# Altium schematic sheet [05] - PROCESSOR 2 of 3, USB and SERIAL.SchDoc
size A2; DocumentNumber: 5; SheetNumber: 5; SheetTotal: 13; NameAuthor: Angle Vu
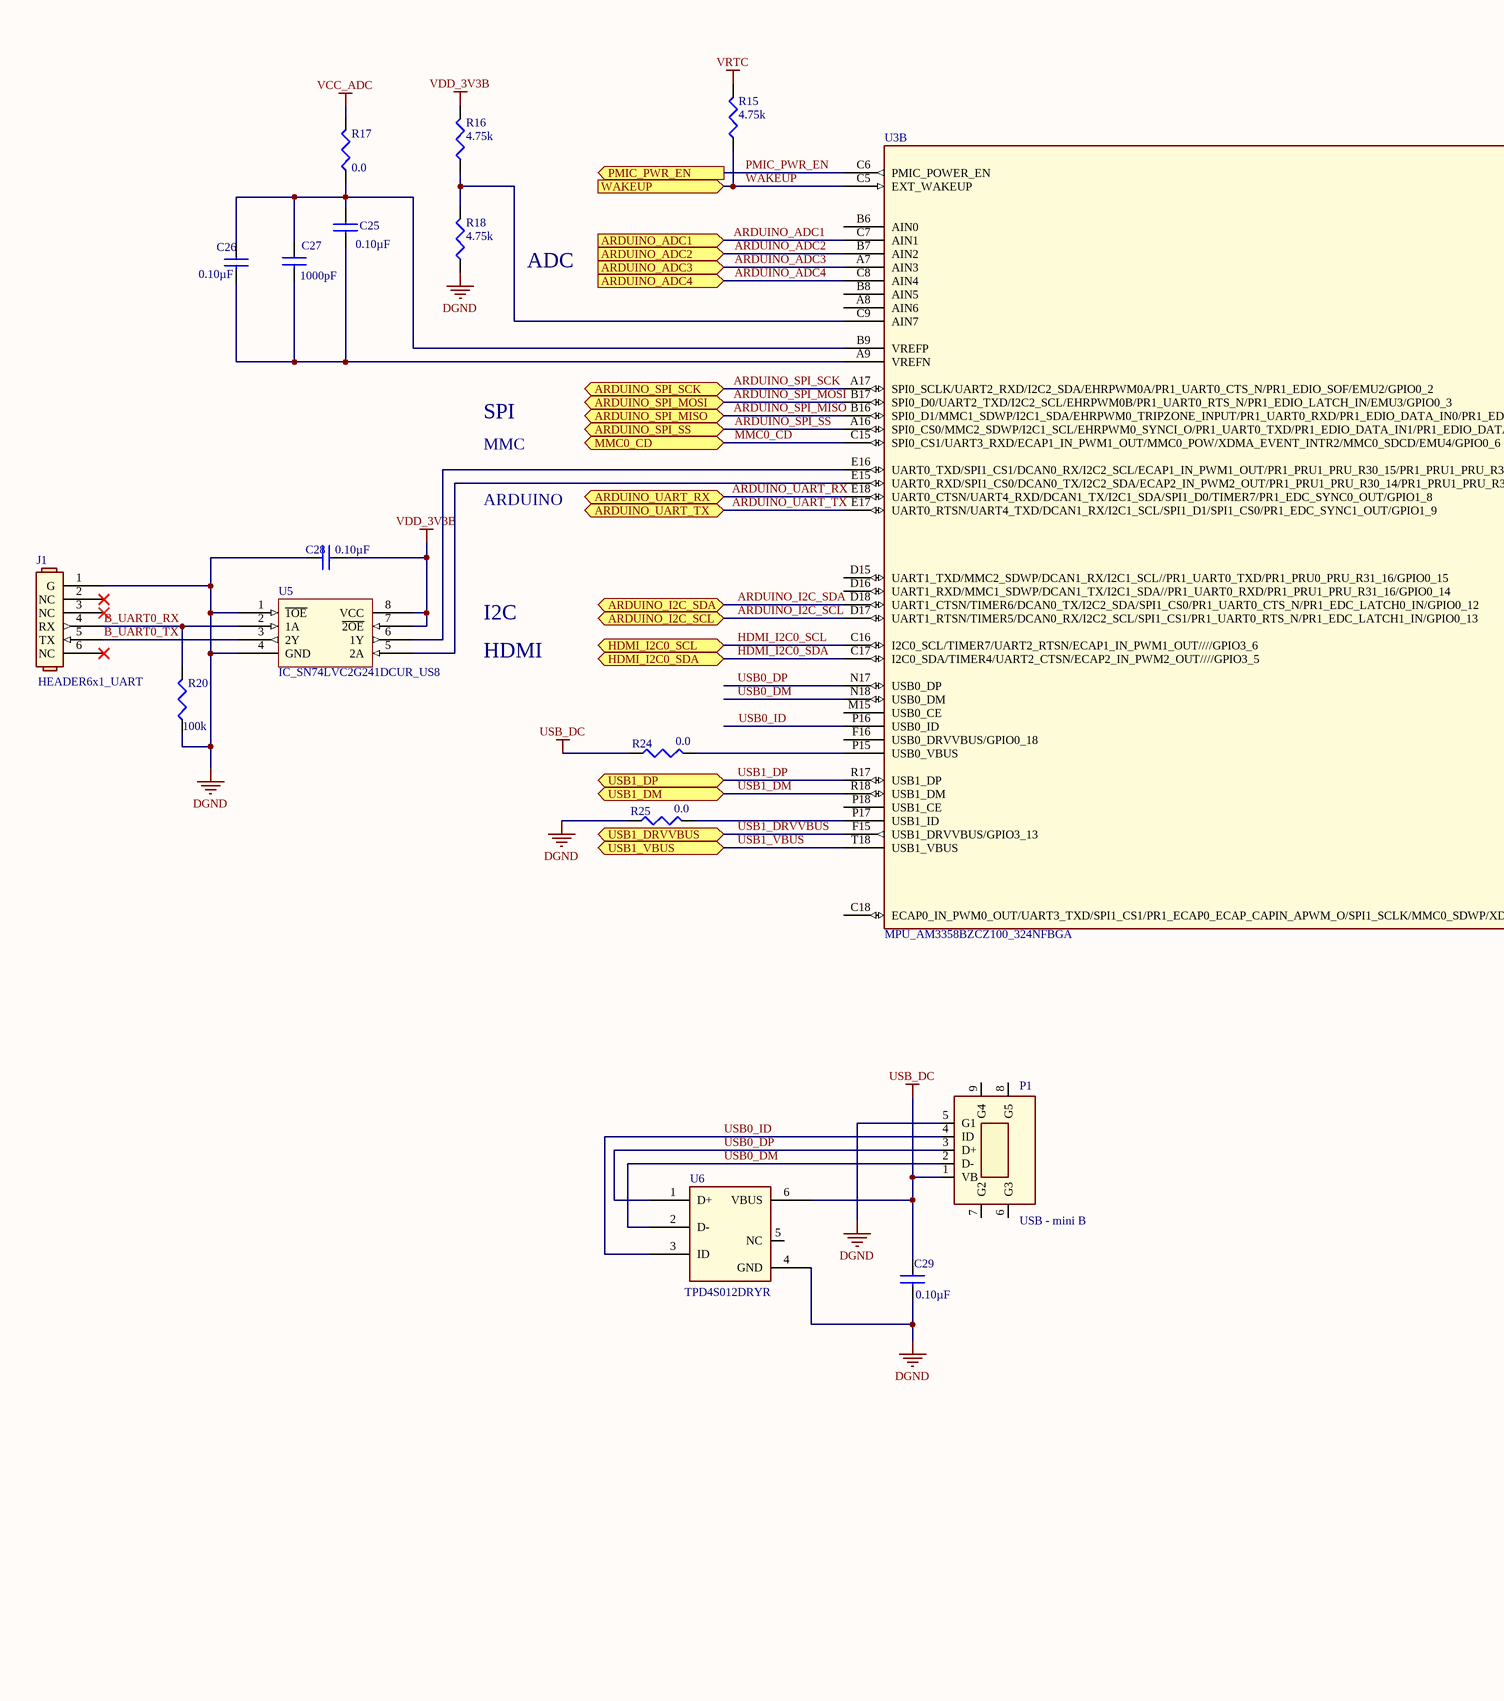
[diagram p0: [05] - PROCESSOR 2 of 3, USB and SERIAL.SchDoc, left]
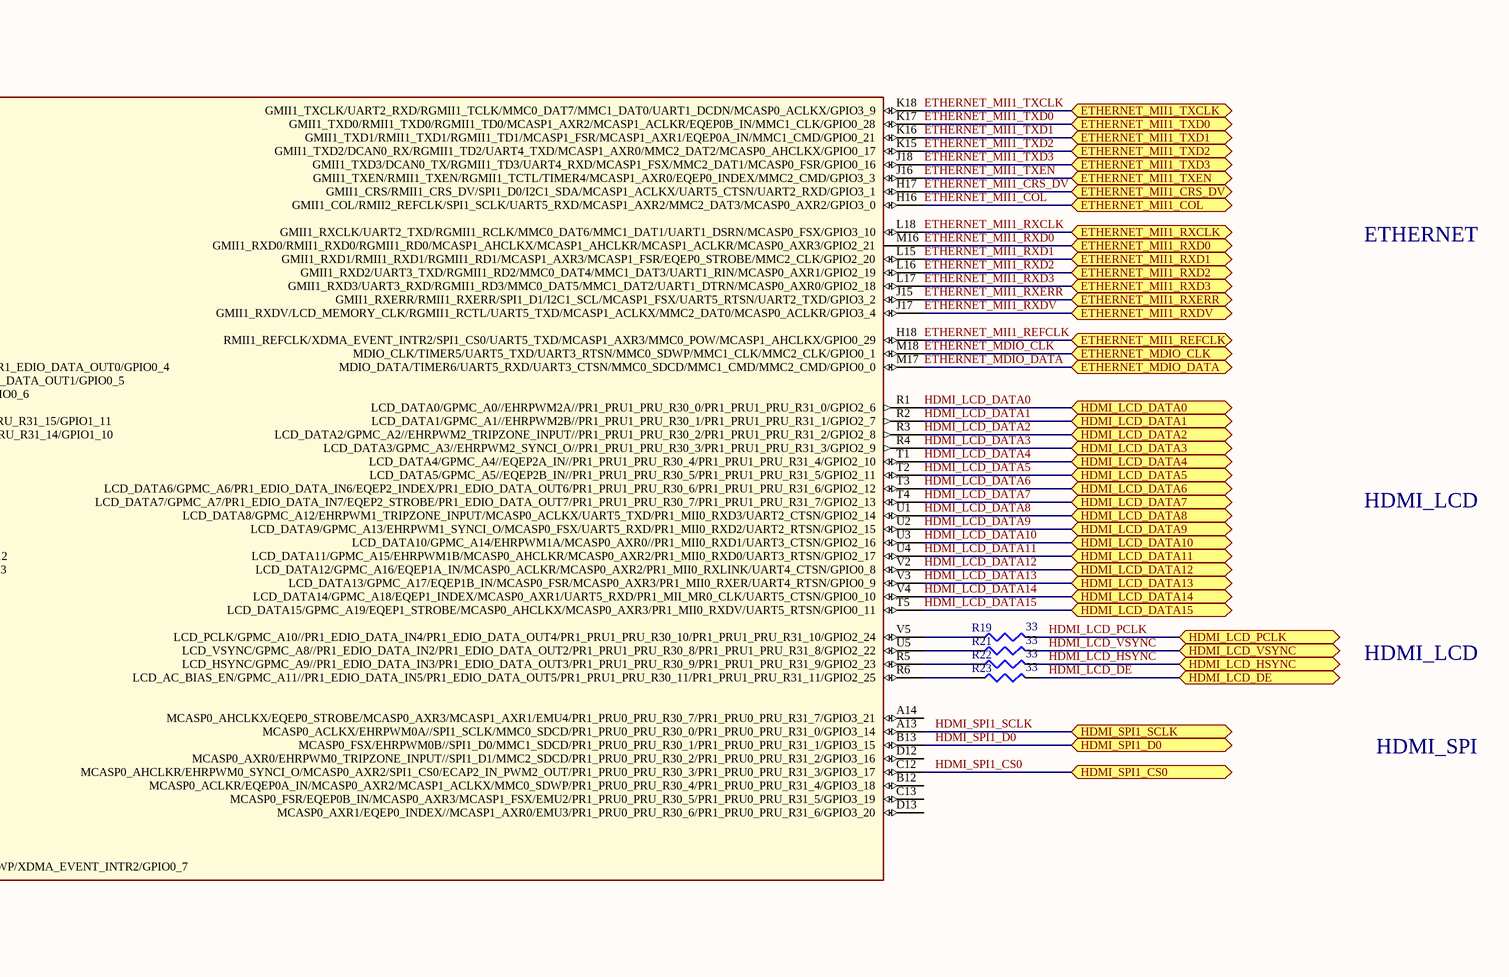
[diagram p1: [05] - PROCESSOR 2 of 3, USB and SERIAL.SchDoc, right]

## Parts
C25  Capacitance: 0.10µF  (hidden comment: C_CER_0.1uF_6.3V_X5R_0402_10%)
C26  Capacitance: 0.10µF  (hidden comment: C_CER_0.1uF_6.3V_X5R_0402_10%)
C27  Capacitance: 1000pF  (hidden comment: C_CER_1000pF_16V_X5R_0402_10%)
C28  Capacitance: 0.10µF  (hidden comment: C_CER_0.1uF_6.3V_X5R_0402_10%)
C29  Capacitance: 0.10µF  (hidden comment: C_CER_0.1uF_6.3V_X5R_0402_10%)
J1  HEADER6x1_UART
P1  Connector Type: USB - mini B  (hidden comment: PWR_MINI_USB_UX60SC-MB-5ST(80))
R15  Resistance (Ohms): 4.75k  (hidden comment: R_4.75K_1/16W_0402_1%)
R16  Resistance (Ohms): 4.75k  (hidden comment: R_4.75K_1/16W_0402_1%)
R17  Resistance (Ohms): 0.0  (hidden comment: R_0OhM_1/16W_0402)
R18  Resistance (Ohms): 4.75k  (hidden comment: R_4.75K_1/16W_0402_1%)
R19  Resistance (Ohms): 33  (hidden comment: R_33_1/16W_0402_5%)
R20  Resistance (Ohms): 100k  (hidden comment: R_100k_1/16W_0402_1%)
R21  Resistance (Ohms): 33  (hidden comment: R_33_1/16W_0402_5%)
R22  Resistance (Ohms): 33  (hidden comment: R_33_1/16W_0402_5%)
R23  Resistance (Ohms): 33  (hidden comment: R_33_1/16W_0402_5%)
R24  Resistance (Ohms): 0.0  (hidden comment: R_0OhM_1/16W_0402)
R25  Resistance (Ohms): 0.0  (hidden comment: R_0OhM_1/16W_0402)
U3  MPU_AM3358BZCZ100_324NFBGA  (part B of 3)
U5  IC_SN74LVC2G241DCUR_US8
U6  Manufacturer Part Number: TPD4S012DRYR  (hidden comment: IC_4CH_ESD_TPD4S012DRYR_6SON)

## Ports
ARDUINO_ADC1 (in), ARDUINO_ADC2 (in), ARDUINO_ADC3 (in), ARDUINO_ADC4 (in), ARDUINO_I2C_SCL (bidir), ARDUINO_I2C_SDA (bidir), ARDUINO_SPI_MISO (bidir), ARDUINO_SPI_MOSI (bidir), ARDUINO_SPI_SCK (bidir), ARDUINO_SPI_SS (bidir), ARDUINO_UART_RX (bidir), ARDUINO_UART_TX (bidir), ETHERNET_MDIO_CLK (bidir), ETHERNET_MDIO_DATA (bidir), ETHERNET_MII1_COL (bidir), ETHERNET_MII1_CRS_DV (bidir), ETHERNET_MII1_REFCLK (bidir), ETHERNET_MII1_RXCLK (bidir), ETHERNET_MII1_RXD0 (bidir), ETHERNET_MII1_RXD1 (bidir), ETHERNET_MII1_RXD2 (bidir), ETHERNET_MII1_RXD3 (bidir), ETHERNET_MII1_RXDV (bidir), ETHERNET_MII1_RXERR (bidir), ETHERNET_MII1_TXCLK (bidir), ETHERNET_MII1_TXD0 (bidir), ETHERNET_MII1_TXD1 (bidir), ETHERNET_MII1_TXD2 (bidir), ETHERNET_MII1_TXD3 (bidir), ETHERNET_MII1_TXEN (bidir), HDMI_I2C0_SCL (bidir), HDMI_I2C0_SDA (bidir), HDMI_LCD_DATA0 (bidir), HDMI_LCD_DATA1 (bidir), HDMI_LCD_DATA2 (bidir), HDMI_LCD_DATA3 (bidir), HDMI_LCD_DATA4 (bidir), HDMI_LCD_DATA5 (bidir), HDMI_LCD_DATA6 (bidir), HDMI_LCD_DATA7 (bidir), HDMI_LCD_DATA8 (bidir), HDMI_LCD_DATA9 (bidir), HDMI_LCD_DATA10 (bidir), HDMI_LCD_DATA11 (bidir), HDMI_LCD_DATA12 (bidir), HDMI_LCD_DATA13 (bidir), HDMI_LCD_DATA14 (bidir), HDMI_LCD_DATA15 (bidir), HDMI_LCD_DE (bidir), HDMI_LCD_HSYNC (bidir), HDMI_LCD_PCLK (bidir), HDMI_LCD_VSYNC (bidir), HDMI_SPI1_CS0 (bidir), HDMI_SPI1_D0 (bidir), HDMI_SPI1_SCLK (bidir), MMC0_CD (bidir), PMIC_PWR_EN (out), USB1_DM (bidir), USB1_DP (bidir), USB1_DRVVBUS (bidir), USB1_VBUS (bidir), WAKEUP (in)

## Nets
DGND: C28.1 C29.2 J1.1(G) P1.5(G1) R18.1 R20.1 R25.1 U5.1(~{1OE}) U5.4(GND) U6.4(GND)
USB_DC: C29.1 P1.1(VB) R24.1 U6.6(VBUS)
VCC_ADC: R17.2
VDD_3V3B: C28.2 R16.2 U5.7(~{2OE}) U5.8(VCC)
VRTC: R15.2
ARDUINO_ADC1: U3.C7(AIN1) ; port ARDUINO_ADC1
ARDUINO_ADC2: U3.B7(AIN2) ; port ARDUINO_ADC2
ARDUINO_ADC3: U3.A7(AIN3) ; port ARDUINO_ADC3
ARDUINO_ADC4: U3.C8(AIN4) ; port ARDUINO_ADC4
ARDUINO_I2C_SCL: U3.D17(UART1_RTSN/TIMER5/DCAN0_RX/I2C2_SCL/SPI1_CS1/PR1_UART0_RTS_N/PR1_EDC_LATCH1_IN/GPIO0_13) ; port ARDUINO_I2C_SCL
ARDUINO_I2C_SDA: U3.D18(UART1_CTSN/TIMER6/DCAN0_TX/I2C2_SDA/SPI1_CS0/PR1_UART0_CTS_N/PR1_EDC_LATCH0_IN/GPIO0_12) ; port ARDUINO_I2C_SDA
ARDUINO_SPI_MISO: U3.B16(SPI0_D1/MMC1_SDWP/I2C1_SDA/EHRPWM0_TRIPZONE_INPUT/PR1_UART0_RXD/PR1_EDIO_DATA_IN0/PR1_EDIO_DATA_OUT0/GPIO0_4) ; port ARDUINO_SPI_MISO
ARDUINO_SPI_MOSI: U3.B17(SPI0_D0/UART2_TXD/I2C2_SCL/EHRPWM0B/PR1_UART0_RTS_N/PR1_EDIO_LATCH_IN/EMU3/GPIO0_3) ; port ARDUINO_SPI_MOSI
ARDUINO_SPI_SCK: U3.A17(SPI0_SCLK/UART2_RXD/I2C2_SDA/EHRPWM0A/PR1_UART0_CTS_N/PR1_EDIO_SOF/EMU2/GPIO0_2) ; port ARDUINO_SPI_SCK
ARDUINO_SPI_SS: U3.A16(SPI0_CS0/MMC2_SDWP/I2C1_SCL/EHRPWM0_SYNCI_O/PR1_UART0_TXD/PR1_EDIO_DATA_IN1/PR1_EDIO_DATA_OUT1/GPIO0_5) ; port ARDUINO_SPI_SS
ARDUINO_UART_RX: U3.E18(UART0_CTSN/UART4_RXD/DCAN1_TX/I2C1_SDA/SPI1_D0/TIMER7/PR1_EDC_SYNC0_OUT/GPIO1_8) ; port ARDUINO_UART_RX
ARDUINO_UART_TX: U3.E17(UART0_RTSN/UART4_TXD/DCAN1_RX/I2C1_SCL/SPI1_D1/SPI1_CS0/PR1_EDC_SYNC1_OUT/GPIO1_9) ; port ARDUINO_UART_TX
B_UART0_RX: J1.4(RX) R20.2 U5.2(1A)
B_UART0_TX: J1.5(TX) U5.3(2Y)
ETHERNET_MDIO_CLK: U3.M18(MDIO_CLK/TIMER5/UART5_TXD/UART3_RTSN/MMC0_SDWP/MMC1_CLK/MMC2_CLK/GPIO0_1) ; port ETHERNET_MDIO_CLK
ETHERNET_MDIO_DATA: U3.M17(MDIO_DATA/TIMER6/UART5_RXD/UART3_CTSN/MMC0_SDCD/MMC1_CMD/MMC2_CMD/GPIO0_0) ; port ETHERNET_MDIO_DATA
ETHERNET_MII1_COL: U3.H16(GMII1_COL/RMII2_REFCLK/SPI1_SCLK/UART5_RXD/MCASP1_AXR2/MMC2_DAT3/MCASP0_AXR2/GPIO3_0) ; port ETHERNET_MII1_COL
ETHERNET_MII1_CRS_DV: U3.H17(GMII1_CRS/RMII1_CRS_DV/SPI1_D0/I2C1_SDA/MCASP1_ACLKX/UART5_CTSN/UART2_RXD/GPIO3_1) ; port ETHERNET_MII1_CRS_DV
ETHERNET_MII1_REFCLK: U3.H18(RMII1_REFCLK/XDMA_EVENT_INTR2/SPI1_CS0/UART5_TXD/MCASP1_AXR3/MMC0_POW/MCASP1_AHCLKX/GPIO0_29) ; port ETHERNET_MII1_REFCLK
ETHERNET_MII1_RXCLK: U3.L18(GMII1_RXCLK/UART2_TXD/RGMII1_RCLK/MMC0_DAT6/MMC1_DAT1/UART1_DSRN/MCASP0_FSX/GPIO3_10) ; port ETHERNET_MII1_RXCLK
ETHERNET_MII1_RXD0: U3.M16(GMII1_RXD0/RMII1_RXD0/RGMII1_RD0/MCASP1_AHCLKX/MCASP1_AHCLKR/MCASP1_ACLKR/MCASP0_AXR3/GPIO2_21) ; port ETHERNET_MII1_RXD0
ETHERNET_MII1_RXD1: U3.L15(GMII1_RXD1/RMII1_RXD1/RGMII1_RD1/MCASP1_AXR3/MCASP1_FSR/EQEP0_STROBE/MMC2_CLK/GPIO2_20) ; port ETHERNET_MII1_RXD1
ETHERNET_MII1_RXD2: U3.L16(GMII1_RXD2/UART3_TXD/RGMII1_RD2/MMC0_DAT4/MMC1_DAT3/UART1_RIN/MCASP0_AXR1/GPIO2_19) ; port ETHERNET_MII1_RXD2
ETHERNET_MII1_RXD3: U3.L17(GMII1_RXD3/UART3_RXD/RGMII1_RD3/MMC0_DAT5/MMC1_DAT2/UART1_DTRN/MCASP0_AXR0/GPIO2_18) ; port ETHERNET_MII1_RXD3
ETHERNET_MII1_RXDV: U3.J17(GMII1_RXDV/LCD_MEMORY_CLK/RGMII1_RCTL/UART5_TXD/MCASP1_ACLKX/MMC2_DAT0/MCASP0_ACLKR/GPIO3_4) ; port ETHERNET_MII1_RXDV
ETHERNET_MII1_RXERR: U3.J15(GMII1_RXERR/RMII1_RXERR/SPI1_D1/I2C1_SCL/MCASP1_FSX/UART5_RTSN/UART2_TXD/GPIO3_2) ; port ETHERNET_MII1_RXERR
ETHERNET_MII1_TXCLK: U3.K18(GMII1_TXCLK/UART2_RXD/RGMII1_TCLK/MMC0_DAT7/MMC1_DAT0/UART1_DCDN/MCASP0_ACLKX/GPIO3_9) ; port ETHERNET_MII1_TXCLK
ETHERNET_MII1_TXD0: U3.K17(GMII1_TXD0/RMII1_TXD0/RGMII1_TD0/MCASP1_AXR2/MCASP1_ACLKR/EQEP0B_IN/MMC1_CLK/GPIO0_28) ; port ETHERNET_MII1_TXD0
ETHERNET_MII1_TXD1: U3.K16(GMII1_TXD1/RMII1_TXD1/RGMII1_TD1/MCASP1_FSR/MCASP1_AXR1/EQEP0A_IN/MMC1_CMD/GPIO0_21) ; port ETHERNET_MII1_TXD1
ETHERNET_MII1_TXD2: U3.K15(GMII1_TXD2/DCAN0_RX/RGMII1_TD2/UART4_TXD/MCASP1_AXR0/MMC2_DAT2/MCASP0_AHCLKX/GPIO0_17) ; port ETHERNET_MII1_TXD2
ETHERNET_MII1_TXD3: U3.J18(GMII1_TXD3/DCAN0_TX/RGMII1_TD3/UART4_RXD/MCASP1_FSX/MMC2_DAT1/MCASP0_FSR/GPIO0_16) ; port ETHERNET_MII1_TXD3
ETHERNET_MII1_TXEN: U3.J16(GMII1_TXEN/RMII1_TXEN/RGMII1_TCTL/TIMER4/MCASP1_AXR0/EQEP0_INDEX/MMC2_CMD/GPIO3_3) ; port ETHERNET_MII1_TXEN
HDMI_I2C0_SCL: U3.C16(I2C0_SCL/TIMER7/UART2_RTSN/ECAP1_IN_PWM1_OUT////GPIO3_6) ; port HDMI_I2C0_SCL
HDMI_I2C0_SDA: U3.C17(I2C0_SDA/TIMER4/UART2_CTSN/ECAP2_IN_PWM2_OUT////GPIO3_5) ; port HDMI_I2C0_SDA
HDMI_LCD_DATA0: U3.R1(LCD_DATA0/GPMC_A0//EHRPWM2A//PR1_PRU1_PRU_R30_0/PR1_PRU1_PRU_R31_0/GPIO2_6) ; port HDMI_LCD_DATA0
HDMI_LCD_DATA1: U3.R2(LCD_DATA1/GPMC_A1//EHRPWM2B//PR1_PRU1_PRU_R30_1/PR1_PRU1_PRU_R31_1/GPIO2_7) ; port HDMI_LCD_DATA1
HDMI_LCD_DATA2: U3.R3(LCD_DATA2/GPMC_A2//EHRPWM2_TRIPZONE_INPUT//PR1_PRU1_PRU_R30_2/PR1_PRU1_PRU_R31_2/GPIO2_8) ; port HDMI_LCD_DATA2
HDMI_LCD_DATA3: U3.R4(LCD_DATA3/GPMC_A3//EHRPWM2_SYNCI_O//PR1_PRU1_PRU_R30_3/PR1_PRU1_PRU_R31_3/GPIO2_9) ; port HDMI_LCD_DATA3
HDMI_LCD_DATA4: U3.T1(LCD_DATA4/GPMC_A4//EQEP2A_IN//PR1_PRU1_PRU_R30_4/PR1_PRU1_PRU_R31_4/GPIO2_10) ; port HDMI_LCD_DATA4
HDMI_LCD_DATA5: U3.T2(LCD_DATA5/GPMC_A5//EQEP2B_IN//PR1_PRU1_PRU_R30_5/PR1_PRU1_PRU_R31_5/GPIO2_11) ; port HDMI_LCD_DATA5
HDMI_LCD_DATA6: U3.T3(LCD_DATA6/GPMC_A6/PR1_EDIO_DATA_IN6/EQEP2_INDEX/PR1_EDIO_DATA_OUT6/PR1_PRU1_PRU_R30_6/PR1_PRU1_PRU_R31_6/GPIO2_12) ; port HDMI_LCD_DATA6
HDMI_LCD_DATA7: U3.T4(LCD_DATA7/GPMC_A7/PR1_EDIO_DATA_IN7/EQEP2_STROBE/PR1_EDIO_DATA_OUT7/PR1_PRU1_PRU_R30_7/PR1_PRU1_PRU_R31_7/GPIO2_13) ; port HDMI_LCD_DATA7
HDMI_LCD_DATA8: U3.U1(LCD_DATA8/GPMC_A12/EHRPWM1_TRIPZONE_INPUT/MCASP0_ACLKX/UART5_TXD/PR1_MII0_RXD3/UART2_CTSN/GPIO2_14) ; port HDMI_LCD_DATA8
HDMI_LCD_DATA9: U3.U2(LCD_DATA9/GPMC_A13/EHRPWM1_SYNCI_O/MCASP0_FSX/UART5_RXD/PR1_MII0_RXD2/UART2_RTSN/GPIO2_15) ; port HDMI_LCD_DATA9
HDMI_LCD_DATA10: U3.U3(LCD_DATA10/GPMC_A14/EHRPWM1A/MCASP0_AXR0//PR1_MII0_RXD1/UART3_CTSN/GPIO2_16) ; port HDMI_LCD_DATA10
HDMI_LCD_DATA11: U3.U4(LCD_DATA11/GPMC_A15/EHRPWM1B/MCASP0_AHCLKR/MCASP0_AXR2/PR1_MII0_RXD0/UART3_RTSN/GPIO2_17) ; port HDMI_LCD_DATA11
HDMI_LCD_DATA12: U3.V2(LCD_DATA12/GPMC_A16/EQEP1A_IN/MCASP0_ACLKR/MCASP0_AXR2/PR1_MII0_RXLINK/UART4_CTSN/GPIO0_8) ; port HDMI_LCD_DATA12
HDMI_LCD_DATA13: U3.V3(LCD_DATA13/GPMC_A17/EQEP1B_IN/MCASP0_FSR/MCASP0_AXR3/PR1_MII0_RXER/UART4_RTSN/GPIO0_9) ; port HDMI_LCD_DATA13
HDMI_LCD_DATA14: U3.V4(LCD_DATA14/GPMC_A18/EQEP1_INDEX/MCASP0_AXR1/UART5_RXD/PR1_MII_MR0_CLK/UART5_CTSN/GPIO0_10) ; port HDMI_LCD_DATA14
HDMI_LCD_DATA15: U3.T5(LCD_DATA15/GPMC_A19/EQEP1_STROBE/MCASP0_AHCLKX/MCASP0_AXR3/PR1_MII0_RXDV/UART5_RTSN/GPIO0_11) ; port HDMI_LCD_DATA15
HDMI_LCD_DE: R23.2 ; port HDMI_LCD_DE
HDMI_LCD_HSYNC: R22.2 ; port HDMI_LCD_HSYNC
HDMI_LCD_PCLK: R19.2 ; port HDMI_LCD_PCLK
HDMI_LCD_VSYNC: R21.2 ; port HDMI_LCD_VSYNC
HDMI_SPI1_CS0: U3.C12(MCASP0_AHCLKR/EHRPWM0_SYNCI_O/MCASP0_AXR2/SPI1_CS0/ECAP2_IN_PWM2_OUT/PR1_PRU0_PRU_R30_3/PR1_PRU0_PRU_R31_3/GPIO3_17) ; port HDMI_SPI1_CS0
HDMI_SPI1_D0: U3.B13(MCASP0_FSX/EHRPWM0B//SPI1_D0/MMC1_SDCD/PR1_PRU0_PRU_R30_1/PR1_PRU0_PRU_R31_1/GPIO3_15) ; port HDMI_SPI1_D0
HDMI_SPI1_SCLK: U3.A13(MCASP0_ACLKX/EHRPWM0A//SPI1_SCLK/MMC0_SDCD/PR1_PRU0_PRU_R30_0/PR1_PRU0_PRU_R31_0/GPIO3_14) ; port HDMI_SPI1_SCLK
MMC0_CD: U3.C15(SPI0_CS1/UART3_RXD/ECAP1_IN_PWM1_OUT/MMC0_POW/XDMA_EVENT_INTR2/MMC0_SDCD/EMU4/GPIO0_6) ; port MMC0_CD
PMIC_PWR_EN: U3.C6(PMIC_POWER_EN) ; port PMIC_PWR_EN
USB0_DM: P1.2(D-) U3.N18(USB0_DM) U6.2(D-)
USB0_DP: P1.3(D+) U3.N17(USB0_DP) U6.1(D+)
USB0_ID: P1.4(ID) U3.P16(USB0_ID) U6.3(ID)
USB1_DM: U3.R18(USB1_DM) ; port USB1_DM
USB1_DP: U3.R17(USB1_DP) ; port USB1_DP
USB1_DRVVBUS: U3.F15(USB1_DRVVBUS/GPIO3_13) ; port USB1_DRVVBUS
USB1_VBUS: U3.T18(USB1_VBUS) ; port USB1_VBUS
WAKEUP: R15.1 U3.C5(EXT_WAKEUP) ; port WAKEUP
NetC25_1: C25.1 C26.1 C27.1 R17.1 U3.B9(VREFP)
NetC25_2: C25.2 C26.2 C27.2 U3.A9(VREFN)
NetR16_1: R16.1 R18.2 U3.C9(AIN7)
NetR19_1: R19.1 U3.V5(LCD_PCLK/GPMC_A10//PR1_EDIO_DATA_IN4/PR1_EDIO_DATA_OUT4/PR1_PRU1_PRU_R30_10/PR1_PRU1_PRU_R31_10/GPIO2_24)
NetR21_1: R21.1 U3.U5(LCD_VSYNC/GPMC_A8//PR1_EDIO_DATA_IN2/PR1_EDIO_DATA_OUT2/PR1_PRU1_PRU_R30_8/PR1_PRU1_PRU_R31_8/GPIO2_22)
NetR22_1: R22.1 U3.R5(LCD_HSYNC/GPMC_A9//PR1_EDIO_DATA_IN3/PR1_EDIO_DATA_OUT3/PR1_PRU1_PRU_R30_9/PR1_PRU1_PRU_R31_9/GPIO2_23)
NetR23_1: R23.1 U3.R6(LCD_AC_BIAS_EN/GPMC_A11//PR1_EDIO_DATA_IN5/PR1_EDIO_DATA_OUT5/PR1_PRU1_PRU_R30_11/PR1_PRU1_PRU_R31_11/GPIO2_25)
NetR24_2: R24.2 U3.P15(USB0_VBUS)
NetR25_2: R25.2 U3.P17(USB1_ID)
NetU3_E15: U3.E15(UART0_RXD/SPI1_CS0/DCAN0_TX/I2C2_SDA/ECAP2_IN_PWM2_OUT/PR1_PRU1_PRU_R30_14/PR1_PRU1_PRU_R31_14/GPIO1_10) U5.5(2A)
NetU3_E16: U3.E16(UART0_TXD/SPI1_CS1/DCAN0_RX/I2C2_SCL/ECAP1_IN_PWM1_OUT/PR1_PRU1_PRU_R30_15/PR1_PRU1_PRU_R31_15/GPIO1_11) U5.6(1Y)

Not connected (* = marked no-connect by the designer): J1 2(NC)* 3(NC)* 6(NC)*; P1 6(G3) 7(G2) 8(G5) 9(G4); U3 A8(AIN6) A14(MCASP0_AHCLKX/EQEP0_STROBE/MCASP0_AXR3/MCASP1_AXR1/EMU4/PR1_PRU0_PRU_R30_7/PR1_PRU0_PRU_R31_7/GPIO3_21) B6(AIN0) B8(AIN5) B12(MCASP0_ACLKR/EQEP0A_IN/MCASP0_AXR2/MCASP1_ACLKX/MMC0_SDWP/PR1_PRU0_PRU_R30_4/PR1_PRU0_PRU_R31_4/GPIO3_18) C13(MCASP0_FSR/EQEP0B_IN/MCASP0_AXR3/MCASP1_FSX/EMU2/PR1_PRU0_PRU_R30_5/PR1_PRU0_PRU_R31_5/GPIO3_19) C18(ECAP0_IN_PWM0_OUT/UART3_TXD/SPI1_CS1/PR1_ECAP0_ECAP_CAPIN_APWM_O/SPI1_SCLK/MMC0_SDWP/XDMA_EVENT_INTR2/GPIO0_7) D12(MCASP0_AXR0/EHRPWM0_TRIPZONE_INPUT//SPI1_D1/MMC2_SDCD/PR1_PRU0_PRU_R30_2/PR1_PRU0_PRU_R31_2/GPIO3_16) D13(MCASP0_AXR1/EQEP0_INDEX//MCASP1_AXR0/EMU3/PR1_PRU0_PRU_R30_6/PR1_PRU0_PRU_R31_6/GPIO3_20) D15(UART1_TXD/MMC2_SDWP/DCAN1_RX/I2C1_SCL//PR1_UART0_TXD/PR1_PRU0_PRU_R31_16/GPIO0_15) D16(UART1_RXD/MMC1_SDWP/DCAN1_TX/I2C1_SDA//PR1_UART0_RXD/PR1_PRU1_PRU_R31_16/GPIO0_14) F16(USB0_DRVVBUS/GPIO0_18) M15(USB0_CE) P18(USB1_CE); U6 5(NC)

## Notes on the sheet
- ADC
- ETHERNET
- SPI
- MMC
- ARDUINO
- HDMI_LCD
- I2C
- HDMI
- HDMI_SPI
- CLOCKS (CPU & PCIE)
- Designed By
- Checked By
- Page Name:
- Size:
- A2
- Company:
- Address:
- Sheet:
- /

## Library data of the parts
C25 C26 C28 C29 = C_CER_0.1uF_6.3V_X5R_0402_10%: CAP CER 0.1UF 6.3V X5R 0402; Manufacturer: Murata Electronics North America; Manufacturer Part Number: GRM155R60J104KA01D; Tolerance: ±10%; Supplier 1: Digi-Key; RoHS: RoHS Compliant; Category: Capacitors; Stock 1: 370000; Pricing 1: 10000=0.0021, 20000=0.002, 30000=0.0019, 50000=0.0017, 100000=0.00138 (USD); Packaging: Tape & Reel (TR); Part Status: Active; Voltage - Rated: 6.3V; Temperature Coefficient: X5R; Operating Temperature: -55°C ~ 85°C; Features: -; Ratings: -; Applications: General Purpose; Failure Rate: *; Mounting Type: Surface Mount, MLCC; Package / Case: 0402 (1005 Metric); Size / Dimension: 0.039" L x 0.020" W (1.00mm x 0.50mm); Height - Seated (Max): -; Thickness (Max): 0.022" (0.55mm); Lead Spacing: -; Lead Style: -; ComponentLink1URL: http://www.murata.com/~/media/webrenewal/support/library/catalog/products/capacitor/mlcc/c02e.pdf; ComponentLink1Description: http://www.murata.com/~/media/webrenewal/support/library/catalog/products/capacitor/mlcc/c02e.pdf; Supplier Part Number 1: 490-6287-2-ND
C27 = C_CER_1000pF_16V_X5R_0402_10%: CAP CER 1000PF 16V X5R 0402; Manufacturer: Murata Electronics North America; Manufacturer Part Number: GRM155R61C102KA01D; Tolerance: ±10%; Supplier 1: Digi-Key; RoHS: RoHS Compliant; Category: Capacitors; Stock 1: 39732; Pricing 1: 1=0.1, 10=0.023, 50=0.0124, 100=0.0105, 250=0.00856, 500=0.00732, 1000=0.0057, 5000=0.00475 (USD); Packaging: Cut Tape (CT); Part Status: Active; Voltage - Rated: 16V; Temperature Coefficient: X5R; Operating Temperature: -55°C ~ 85°C; Features: -; Ratings: -; Applications: General Purpose; Failure Rate: *; Mounting Type: Surface Mount, MLCC; Package / Case: 0402 (1005 Metric); Size / Dimension: 0.039" L x 0.020" W (1.00mm x 0.50mm); Height - Seated (Max): -; Thickness (Max): 0.022" (0.55mm); Lead Spacing: -; Lead Style: *; ComponentLink1URL: http://www.murata.com/~/media/webrenewal/support/library/catalog/products/capacitor/mlcc/c02e.pdf; ComponentLink1Description: http://www.murata.com/~/media/webrenewal/support/library/catalog/products/capacitor/mlcc/c02e.pdf; Supplier Part Number 1: 490-6308-1-ND
J1 = HEADER6x1_MALE_HOLE100: CONN HEADER 6POS .100 STR TIN; Manufacturer: Amphenol FCI; Manufacturer Part Number: 68000-406HLF; Connector Type: Header, Unshrouded; Number of Positions: 6; Number of Positions Loaded: All; Pitch: 0.100" (2.54mm); Supplier 1: Digi-Key; RoHS: RoHS Compliant; Category: Connectors, Interconnects; Stock 1: 39050; Pricing 1: 1=0.25, 10=0.233, 25=0.1988, 100=0.1615, 250=0.14284, 500=0.13662, 1000=0.11178, 2500=0.10246, 5000=0.09936 (USD); Packaging: Bulk; Part Status: Active; Contact Type: Male Pin; Number of Rows: 1; Row Spacing: -; Contact Mating Length: 0.230" (5.84mm); Mounting Type: Through Hole; Termination: Solder; Fastening Type: -; Features: -; Contact Finish: Tin; Contact Finish Thickness: 100µin (2.54µm); Color: Black; ComponentLink1URL: http://portal.fciconnect.com/Comergent//fci/drawing/68000.pdf; ComponentLink1Description: http://portal.fciconnect.com/Comergent//fci/drawing/68000.pdf; Supplier Part Number 1: 609-3263-ND
P1 = PWR_MINI_USB_UX60SC-MB-5ST(80): CONN RCPT USB MINI B R/A SMD; Manufacturer: Hirose Electric Co Ltd; Number of Contacts: 5; Gender: Receptacle; Specifications: USB 2.0; Supplier 1: Digi-Key; Manufacturer Part Number: UX60SC-MB-5ST(80); RoHS: RoHS Compliant; Category: Connectors, Interconnects; Stock 1: 33000; Pricing 1: 1500=0.375, 3000=0.3625, 7500=0.35, 10500=0.3325, 15000=0.325 (USD); Packaging: Tape & Reel (TR); Part Status: Active; Mounting Type: Surface Mount, Right Angle, Horizontal; Features: Solder Retention; Ingress Protection: -; ComponentLink1URL: http://media.digikey.com/pdf/Data%20Sheets/Hirose%20PDFs/UX60S.pdf; ComponentLink1Description: http://media.digikey.com/pdf/Data%20Sheets/Hirose%20PDFs/UX60S.pdf; Supplier Part Number 1: H11671TR-ND
R15 R16 R18 = R_4.75K_1/16W_0402_1%: RES SMD 4.75K OHM 1% 1/16W 0402; Manufacturer: Vishay Dale; Manufacturer Part Number: CRCW04024K75FKED; Power (Watts): 0.063W, 1/16W; Temperature Coefficient: ±100ppm/°C; Supplier 1: Digi-Key; RoHS: RoHS Compliant; Category: Resistors; Stock 1: 360000; Pricing 1: 10000=0.0033, 30000=0.0029, 50000=0.00266, 100000=0.00261 (USD); Packaging: Tape & Reel (TR); Part Status: Active; Tolerance: ±1%; Composition: Thick Film; Features: Automotive AEC-Q200; Operating Temperature: -55°C ~ 155°C; Package / Case: 0402 (1005 Metric); Supplier Device Package: 0402; Size / Dimension: 0.039" L x 0.020" W (1.00mm x 0.50mm); Height: 0.016" (0.40mm); Number of Terminations: 2; Failure Rate: -; ComponentLink1URL: http://www.vishay.com/docs/20035/dcrcwe3.pdf; ComponentLink1Description: http://www.vishay.com/docs/20035/dcrcwe3.pdf; Supplier Part Number 1: 541-4.75KLTR-ND
R17 R24 R25 = R_0OhM_1/16W_0402: RES SMD 0.0OHM JUMPER 1/16W 0402; Manufacturer: Yageo; Manufacturer Part Number: RC0402JR-070RL; Power (Watts): 0.063W, 1/16W; Supplier 1: Digi-Key; RoHS: RoHS Compliant; Category: Resistors; Stock 1: 13978228; Pricing 1: 1=0.1, 10=0.013, 25=0.0092, 100=0.0053, 250=0.004, 500=0.0032, 1000=0.00236, 2500=0.00205, 5000=0.00169 (USD); Packaging: Cut Tape (CT); Part Status: Active; Tolerance: Jumper; Composition: Thick Film; Features: Moisture Resistant; Temperature Coefficient: -; Operating Temperature: -55°C ~ 155°C; Package / Case: 0402 (1005 Metric); Supplier Device Package: 0402; Size / Dimension: 0.039" L x 0.020" W (1.00mm x 0.50mm); Height: 0.016" (0.40mm); Number of Terminations: 2; Failure Rate: -; ComponentLink1URL: http://www.yageo.com/documents/recent/PYu-RC_Group_51_RoHS_L_04.pdf; ComponentLink1Description: http://www.yageo.com/documents/recent/PYu-RC_Group_51_RoHS_L_04.pdf; Supplier Part Number 1: 311-0.0JRCT-ND
R19 R21-R23 = R_33_1/16W_0402_5%: RES SMD 33 OHM 5% 1/16W 0402; Manufacturer: Yageo; Manufacturer Part Number: RC0402JR-0733RL; Power (Watts): 0.063W, 1/16W; Temperature Coefficient: ±100ppm/°C; Supplier 1: Digi-Key; RoHS: RoHS Compliant; Category: Resistors; Stock 1: 1941028; Pricing 1: 1=0.1, 10=0.012, 25=0.0084, 100=0.0047, 250=0.0036, 500=0.0029, 1000=0.00213, 2500=0.00185, 5000=0.00153 (USD); Packaging: Cut Tape (CT); Part Status: Active; Tolerance: ±5%; Composition: Thick Film; Features: Moisture Resistant; Operating Temperature: -55°C ~ 155°C; Package / Case: 0402 (1005 Metric); Supplier Device Package: 0402; Size / Dimension: 0.039" L x 0.020" W (1.00mm x 0.50mm); Height: 0.016" (0.40mm); Number of Terminations: 2; Failure Rate: -; ComponentLink1URL: http://www.yageo.com/documents/recent/PYu-RC_Group_51_RoHS_L_04.pdf; ComponentLink1Description: http://www.yageo.com/documents/recent/PYu-RC_Group_51_RoHS_L_04.pdf; Supplier Part Number 1: 311-33JRCT-ND
R20 = R_100k_1/16W_0402_1%: RES SMD 100K OHM 1% 1/16W 0402; Manufacturer: Vishay Dale; Manufacturer Part Number: CRCW0402100KFKED; Power (Watts): 0.063W, 1/16W; Temperature Coefficient: ±100ppm/°C; Supplier 1: Digi-Key; RoHS: RoHS Compliant; Category: Resistors; Stock 1: 1287000; Pricing 1: 10000=0.0033, 30000=0.0029, 50000=0.00266, 100000=0.00261 (USD); Packaging: Tape & Reel (TR); Part Status: Active; Tolerance: ±1%; Composition: Thick Film; Features: Automotive AEC-Q200; Operating Temperature: -55°C ~ 155°C; Package / Case: 0402 (1005 Metric); Supplier Device Package: 0402; Size / Dimension: 0.039" L x 0.020" W (1.00mm x 0.50mm); Height: 0.016" (0.40mm); Number of Terminations: 2; Failure Rate: -; ComponentLink1URL: http://www.vishay.com/docs/20035/dcrcwe3.pdf; ComponentLink1Description: http://www.vishay.com/docs/20035/dcrcwe3.pdf; Supplier Part Number 1: 541-100KLTR-ND
U3 = MPU_AM3358BZCZ100_324NFBGA: IC MPU SITARA 1.0GHZ 324NFBGA; Manufacturer: Texas Instruments; Core Processor: ARM® Cortex®-A8; Number of Cores/Bus Width: 1 Core, 32-Bit; Co-Processors/DSP: Multimedia; NEON™ SIMD; RAM Controllers: LPDDR, DDR2, DDR3, DDR3L; Graphics Acceleration: Yes; Display & Interface Controllers: LCD, Touchscreen; Ethernet: 10/100/1000 Mbps (2); USB: USB 2.0 + PHY (2); Voltage - I/O: 1.8V, 3.3V; Security Features: Cryptography, Random Number Generator; Additional Interfaces: CAN, I²C, McASP, McSPI, MMC/SD/SDIO, UART; Supplier 1: Digi-Key; Manufacturer Part Number: AM3358BZCZ100; RoHS: RoHS Compliant; Category: Integrated Circuits (ICs); Stock 1: 6211; Pricing 1: 1=19.56, 10=17.978, 100=15.1835, 500=13.50676, 1000=12.38895, 2500=11.9232, 5000=11.64375 (USD); Packaging: Tube; Part Status: Active; Speed: 1.0GHz; SATA: -; Operating Temperature: 0°C ~ 90°C (TJ); Package / Case: 324-LFBGA; Supplier Device Package: 324-NFBGA(15x15); ComponentLink1URL: http://www.ti.com/lit/ds/symlink/am3352.pdf; ComponentLink1Description: http://www.ti.com/lit/ds/symlink/am3352.pdf; Supplier Part Number 1: 296-35869-5-ND
U5 = IC_SN74LVC2G241DCUR_US8: IC BUFF/DVR TRI-ST DL US8; Manufacturer: Texas Instruments; Logic Type: Buffer, Non-Inverting; Number of Elements: 2; Number of Bits per Element: 1; Output Type: Push-Pull; Current - Output High, Low: 32mA, 32mA; Voltage - Supply: 1.65 V ~ 5.5 V; Supplier 1: Digi-Key; Manufacturer Part Number: SN74LVC2G241DCUR; RoHS: RoHS Compliant; Category: Integrated Circuits (ICs); Stock 1: 30000; Pricing 1: 3000=0.2015, 6000=0.1885, 15000=0.1755, 30000=0.1664, 75000=0.1625 (USD); Packaging: Tape & Reel (TR); Part Status: Active; Input Type: -; Operating Temperature: -40°C ~ 125°C (TA); Mounting Type: Surface Mount; Package / Case: 8-VFSOP (0.091", 2.30mm Width); Supplier Device Package: US8; ComponentLink1URL: http://www.ti.com/lit/ds/symlink/sn74lvc2g241.pdf; ComponentLink1Description: http://www.ti.com/lit/ds/symlink/sn74lvc2g241.pdf; Supplier Part Number 1: 296-11936-2-ND
U6 = IC_4CH_ESD_TPD4S012DRYR_6SON: IC 4CH ESD SOLUTION W/CLAMP 6SON; Manufacturer: Texas Instruments; Power (Watts): 60W; Number of Circuits: 4; Supplier 1: Digi-Key; RoHS: RoHS Compliant; Category: Circuit Protection; Stock 1: 35000; Pricing 1: 5000=0.23625 (USD); Packaging: Tape & Reel (TR); Part Status: Active; Voltage - Working: -; Voltage - Clamping: -; Technology: Mixed Technology; Applications: USB; Package / Case: 6-UFDFN; Supplier Device Package: 6-SON (1.45x1); ComponentLink1URL: http://www.ti.com/lit/ds/symlink/tpd4s012.pdf; ComponentLink1Description: http://www.ti.com/lit/ds/symlink/tpd4s012.pdf; Supplier Part Number 1: 296-24244-2-ND